# Altium schematic sheet Connector.SchDoc
size A4; SheetNumber: 3; SheetTotal: 3
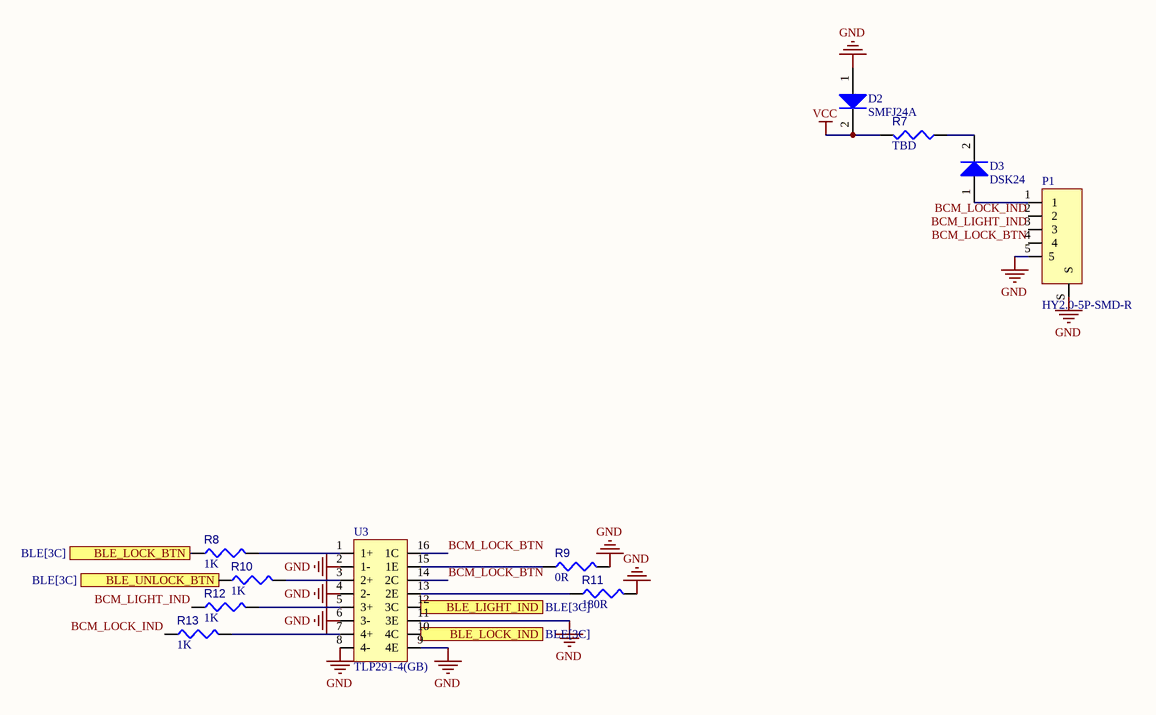
[diagram p0: Connector.SchDoc]

## Parts
D2  SMFJ24A  [SOD-123FL]
D3  DSK24  [SOD-123FL]
P1  HY2.0-5P-SMD-R  [HY2.0-5P-SMD-R]
R7  value TBD  [RESC2013X70X40LL20T20]  (hidden comment: 0805 Chip Resistor)
R8  value 1K  [RESC1608X55X25LL10T15]  (hidden comment: 1K 0603)
R9  value 0R  [RESC2013X70X40LL20T20]  (hidden comment: 0R 0805)
R10  value 1K  [RESC1608X55X25LL10T15]  (hidden comment: 1K 0603)
R11  value 180R  [RESC2013X70X40LL20T20]  (hidden comment: 180R 0805)
R12  value 1K  [RESC1608X55X25LL10T15]  (hidden comment: 1K 0603)
R13  value 1K  [RESC1608X55X25LL10T15]  (hidden comment: 1K 0603)
U3  TLP291-4(GB)  [SOP127P700X210-16L]

## Ports
BLE_LIGHT_IND (see BLE[3C]), BLE_LOCK_BTN (see BLE[3C]), BLE_LOCK_IND (see BLE[3C]), BLE_UNLOCK_BTN (see BLE[3C])

## Nets
GND: D2.1(A) P1.5 P1.S R9.2 R11.2 U3.2(1-) U3.4(2-) U3.6(3-) U3.8(4-) U3.9(4E) U3.11(3E)
VCC: D2.2(K) R7.2
BCM_LIGHT_IND: P1.3 R12.1
BCM_LOCK_BTN: P1.4 U3.14(2C) U3.16(1C)
BCM_LOCK_IND: P1.2 R13.1
BLE_LIGHT_IND: U3.12(3C) ; port BLE_LIGHT_IND
BLE_LOCK_BTN: R8.1 ; port BLE_LOCK_BTN
BLE_LOCK_IND: U3.10(4C) ; port BLE_LOCK_IND
BLE_UNLOCK_BTN: R10.1 ; port BLE_UNLOCK_BTN
NetD3_1: D3.1(A) P1.1
NetD3_2: D3.2(K) R7.1
NetR8_2: R8.2 U3.1(1+)
NetR9_1: R9.1 U3.15(1E)
NetR10_2: R10.2 U3.3(2+)
NetR11_1: R11.1 U3.13(2E)
NetR12_2: R12.2 U3.5(3+)
NetR13_2: R13.2 U3.7(4+)

## Library data of the parts
D2 = SMFJ24A: TVS Diode; Package: SOD-123FL; Pins: 2
D3 = DSK24: 40V 2A Schottky barrier diode; Package: SOD-123FL; Pin: 2; Type: Schottky
P1 = HY2.0-5P-SMD-R: HY2.0 5P SMD Right angle; Pins: 5; Type: HY2.0
R7 = 0805 Chip Resistor: 0805 Universal Chip Resistor; Case/Size Code: 0805; Pins: 2
R8 R10 R12 R13 = 1K 0603: 0603 Chip Resistor; Case/Size Code: 0603; Pins: 2
R9 = 0R 0805: 0805 Chip Resistor; Case/Size Code: 0805; Pins: 2
R11 = 180R 0805: 0805 Chip Resistor; Case/Size Code: 0805; Pins: 2
U3 = TLP291-4(GB): Photocouplers GaAs Infrared LED & Photo Transistor CTR 100; Package: SO-16